# EAGLE design dip8 (EAGLE 6.5.0)
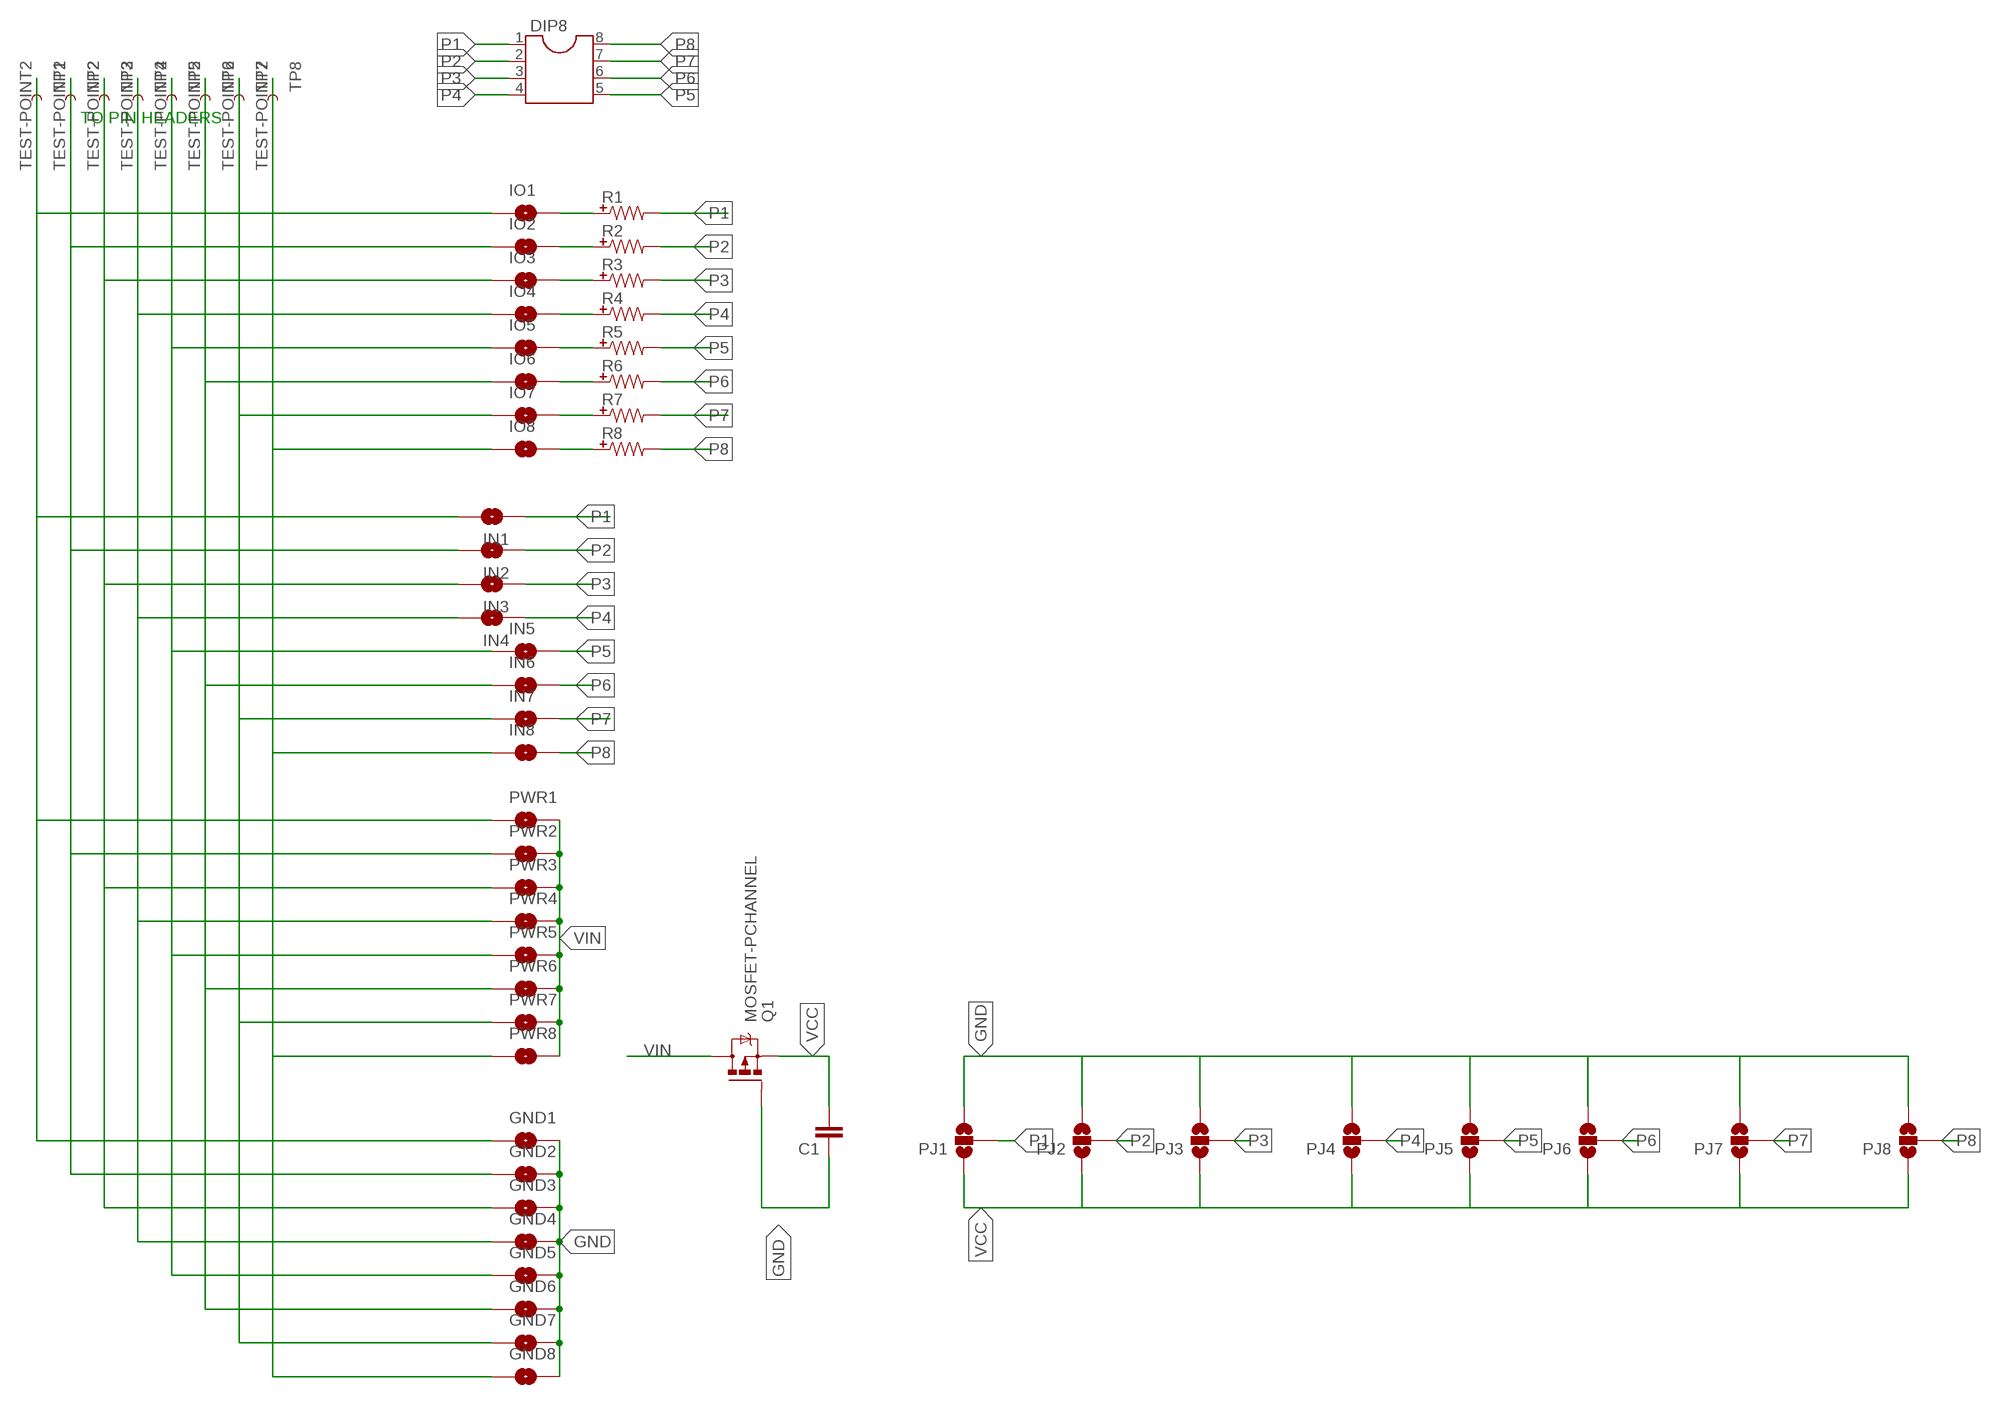
[diagram p0: schematic, sheet 1]

## Parts
C1  CAPUNIVERSAL  [0402-0603-0805-UNIVERSAL]
DIP8  DIL8  [DIL08]
GND1  SOLDERJUMPERNO  [SJ_2S-NO]
GND2  SOLDERJUMPERNO  [SJ_2S-NO]
GND3  SOLDERJUMPERNO  [SJ_2S-NO]
GND4  SOLDERJUMPERNO  [SJ_2S-NO]
GND5  SOLDERJUMPERNO  [SJ_2S-NO]
GND6  SOLDERJUMPERNO  [SJ_2S-NO]
GND7  SOLDERJUMPERNO  [SJ_2S-NO]
GND8  SOLDERJUMPERNO  [SJ_2S-NO]
IN1  SOLDERJUMPERNO  [SJ_2S-NO]
IN2  SOLDERJUMPERNO  [SJ_2S-NO]
IN3  SOLDERJUMPERNO  [SJ_2S-NO]
IN4  SOLDERJUMPERNO  [SJ_2S-NO]
IN5  SOLDERJUMPERNO  [SJ_2S-NO]
IN6  SOLDERJUMPERNO  [SJ_2S-NO]
IN7  SOLDERJUMPERNO  [SJ_2S-NO]
IN8  SOLDERJUMPERNO  [SJ_2S-NO]
IO1  SOLDERJUMPERNO  [SJ_2S-NO]
IO2  SOLDERJUMPERNO  [SJ_2S-NO]
IO3  SOLDERJUMPERNO  [SJ_2S-NO]
IO4  SOLDERJUMPERNO  [SJ_2S-NO]
IO5  SOLDERJUMPERNO  [SJ_2S-NO]
IO6  SOLDERJUMPERNO  [SJ_2S-NO]
IO7  SOLDERJUMPERNO  [SJ_2S-NO]
IO8  SOLDERJUMPERNO  [SJ_2S-NO]
PJ1  SOLDERJUMPER_2WAYT  [SJ_2]
PJ2  SOLDERJUMPER_2WAYT  [SJ_2]
PJ3  SOLDERJUMPER_2WAYT  [SJ_2]
PJ4  SOLDERJUMPER_2WAYT  [SJ_2]
PJ5  SOLDERJUMPER_2WAYT  [SJ_2]
PJ6  SOLDERJUMPER_2WAYT  [SJ_2]
PJ7  SOLDERJUMPER_2WAYT  [SJ_2]
PJ8  SOLDERJUMPER_2WAYT  [SJ_2]
PWR1  SOLDERJUMPERNO  [SJ_2S-NO]
PWR2  SOLDERJUMPERNO  [SJ_2S-NO]
PWR3  SOLDERJUMPERNO  [SJ_2S-NO]
PWR4  SOLDERJUMPERNO  [SJ_2S-NO]
PWR5  SOLDERJUMPERNO  [SJ_2S-NO]
PWR6  SOLDERJUMPERNO  [SJ_2S-NO]
PWR7  SOLDERJUMPERNO  [SJ_2S-NO]
PWR8  SOLDERJUMPERNO  [SJ_2S-NO]
Q1  MOSFET-PCHANNEL  [SOT23-3]
R1  RESISTORUNIVERSAL  [0402-0603-0805-UNIVERSAL]
R2  RESISTORUNIVERSAL  [0402-0603-0805-UNIVERSAL]
R3  RESISTORUNIVERSAL  [0402-0603-0805-UNIVERSAL]
R4  RESISTORUNIVERSAL  [0402-0603-0805-UNIVERSAL]
R5  RESISTORUNIVERSAL  [0402-0603-0805-UNIVERSAL]
R6  RESISTORUNIVERSAL  [0402-0603-0805-UNIVERSAL]
R7  RESISTORUNIVERSAL  [0402-0603-0805-UNIVERSAL]
R8  RESISTORUNIVERSAL  [0402-0603-0805-UNIVERSAL]
TP1  TEST-POINT2  [PAD.02X.02]
TP2  TEST-POINT2  [PAD.02X.02]
TP3  TEST-POINT2  [PAD.02X.02]
TP4  TEST-POINT2  [PAD.02X.02]
TP5  TEST-POINT2  [PAD.02X.02]
TP6  TEST-POINT2  [PAD.02X.02]
TP7  TEST-POINT2  [PAD.02X.02]
TP8  TEST-POINT2  [PAD.02X.02]

## Nets
C1: GND1.1 IN1.2 IO1.1 PWR1.1 TP1.P$1
C2: GND2.1 IN2.2 IO2.1 PWR2.1 TP2.P$1
C3: GND3.1 IN3.2 IO3.1 PWR3.1 TP3.P$1
C4: GND4.1 IN4.2 IO4.1 PWR4.1 TP4.P$1
C5: GND5.1 IN5.1 IO5.1 PWR5.1 TP5.P$1
C6: GND6.1 IN6.1 IO6.1 PWR6.1 TP6.P$1
C7: GND7.1 IN7.1 IO7.1 PWR7.1 TP7.P$1
C8: GND8.1 IN8.1 IO8.1 PWR8.1 TP8.P$1
GND: C1.- GND1.2 GND2.2 GND3.2 GND4.2 GND5.2 GND6.2 GND7.2 GND8.2 PJ1.3 PJ2.3 PJ3.3 PJ4.3 PJ5.3 PJ6.3 PJ7.3 PJ8.3 Q1.1(G)
N$9: IO1.2 R1.+
N$10: IO2.2 R2.+
N$11: IO3.2 R3.+
N$12: IO4.2 R4.+
N$13: IO5.2 R5.+
N$14: IO6.2 R6.+
N$15: IO7.2 R7.+
N$16: IO8.2 R8.+
P1: DIP8.1 IN1.1 PJ1.2 R1.-
P2: DIP8.2 IN2.1 PJ2.2 R2.-
P3: DIP8.3 IN3.1 PJ3.2 R3.-
P4: DIP8.4 IN4.1 PJ4.2 R4.-
P5: DIP8.5 IN5.2 PJ5.2 R5.-
P6: DIP8.6 IN6.2 PJ6.2 R6.-
P7: DIP8.7 IN7.2 PJ7.2 R7.-
P8: DIP8.8 IN8.2 PJ8.2 R8.-
VCC: C1.+ PJ1.1 PJ2.1 PJ3.1 PJ4.1 PJ5.1 PJ6.1 PJ7.1 PJ8.1 Q1.2(S)
VIN: PWR1.2 PWR2.2 PWR3.2 PWR4.2 PWR5.2 PWR6.2 PWR7.2 PWR8.2 Q1.3(D)

## Notes on the sheet
- TO PIN HEADERS

## Library data of the parts
C1 = tekdemo:CAP: Capacitor Standard 0603 ceramic capacitor, and 0.1" leaded capacitor.
DIP8 = ic-package:DIL8: Dual In Line / Socket
GND1-GND8 IN1-IN8 IO1-IO8 PWR1-PWR8 = SparkFun-Passives:SOLDERJUMPER: Solder Jumper Standard SMD solder jumper. Used to automate production. Two varients : Normally Open and Normally Closed are the same, but have different paste layers. NC will have a large amount of paste and should jumper during reflow.
PJ1-PJ8 = SparkFun-Passives:SOLDERJUMPER_2WAY: Solder Jumper 2 way solder jumper
Q1 = tekdemo:MOSFET-PCHANNEL: Generic PMOSFET; PROD_ID: TRANS-08285
R1-R8 = tekdemo:RESISTOR: Resistor Basic schematic elements and footprints for 0603, 1206, and PTH resistors.
TP1-TP8 = SparkFun-Passives:TEST-POINT: Bare copper test points for troubleshooting or ICT

## Board
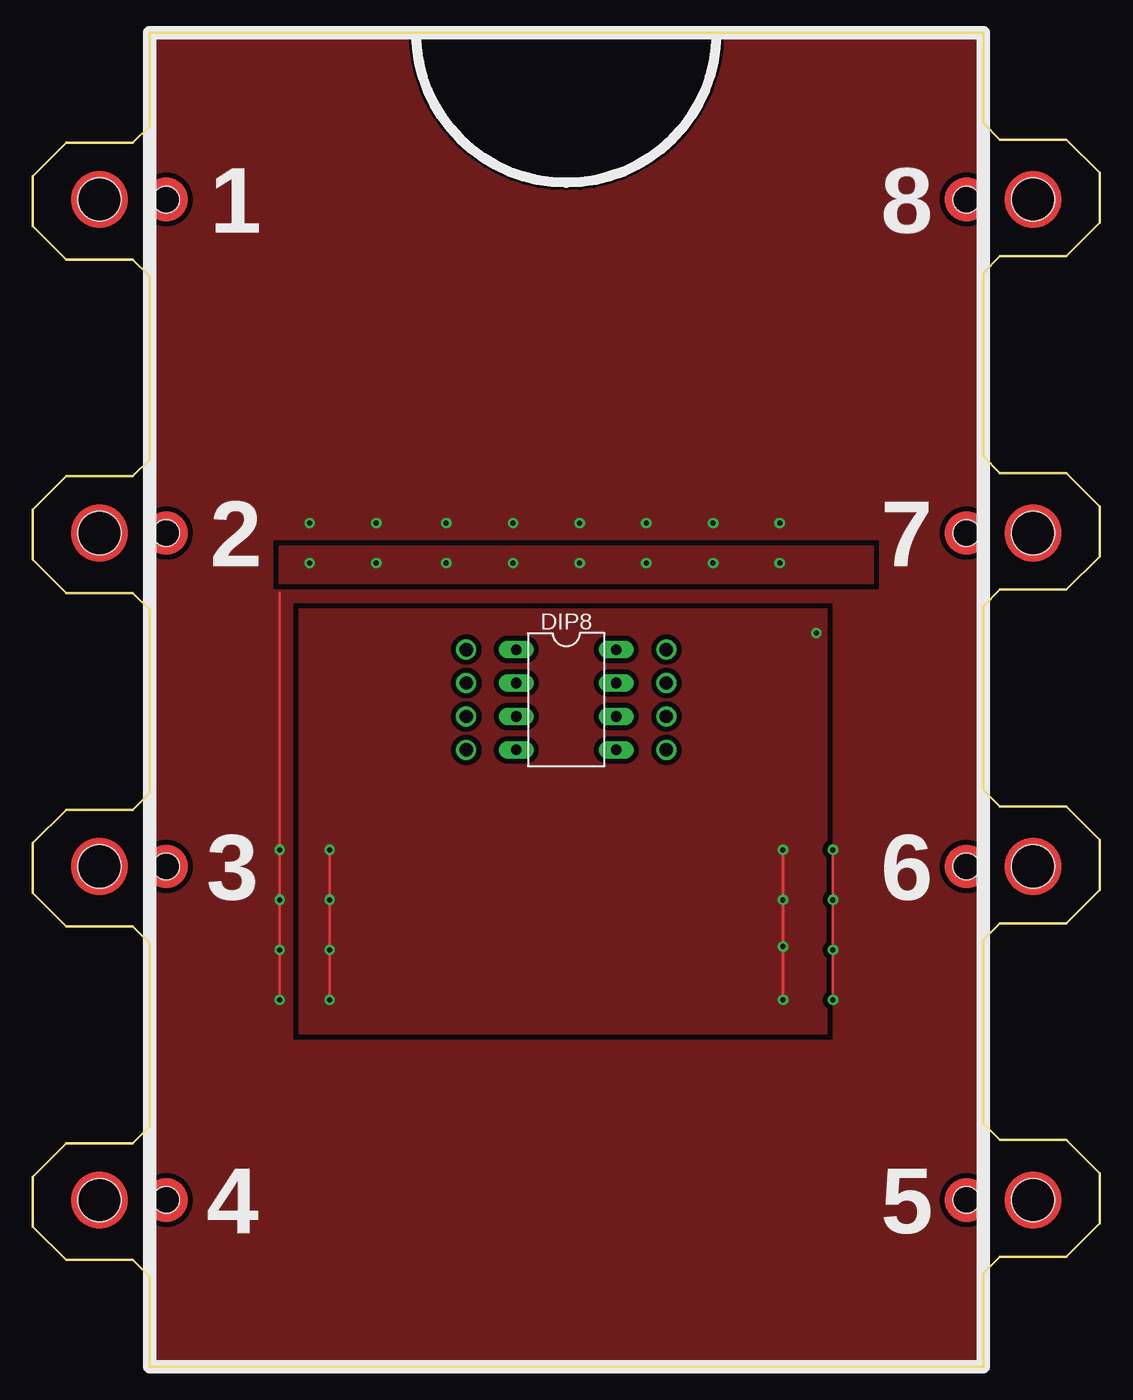
[diagram p1: board, top side]
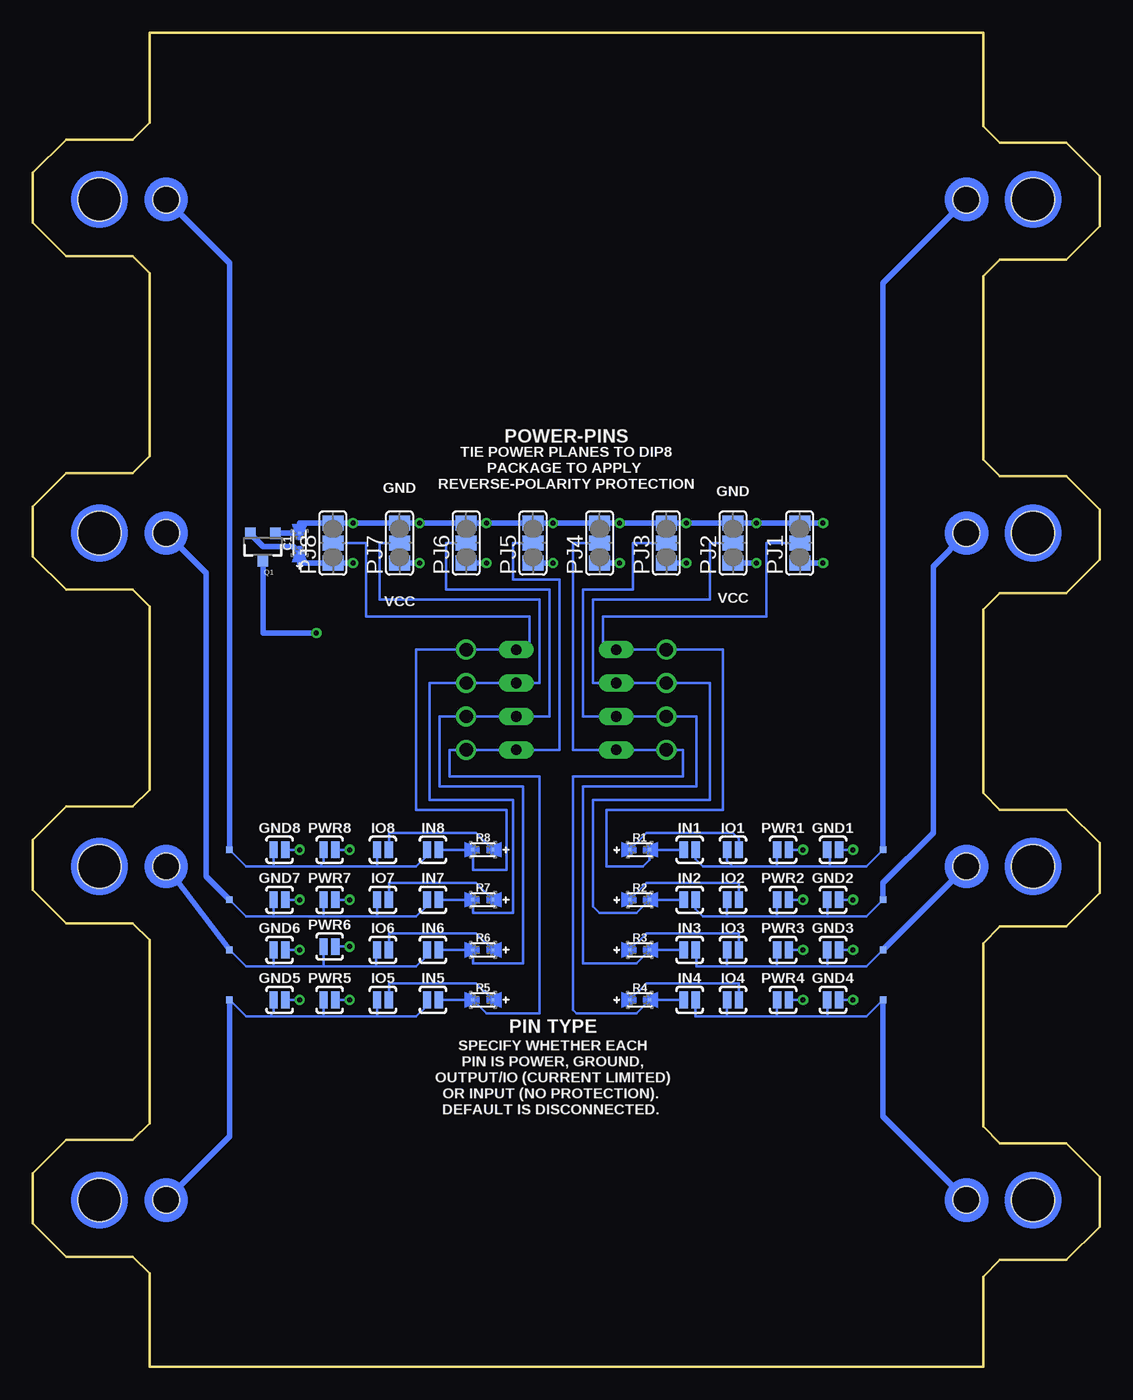
[diagram p2: board, bottom side, seen from below]

Size 81.28 x 101.6 mm. Coordinates in mm from the lower left corner, seen from the top.
Outline: 8.89,0 8.89,6.86 7.62,8.13 2.54,8.13 0,10.67 0,14.48 2.54,17.02 7.62,17.02 8.89,18.29 8.89,32.26 7.62,33.53 2.54,33.53 0,36.07 0,39.88 2.54,42.42 7.62,42.42 8.89,43.69 8.89,57.66 7.62,58.93 2.54,58.93 0,61.47 0,65.28 2.54,67.82 7.62,67.82 8.89,69.09 8.89,83.06 7.62,84.33 2.54,84.33 0,86.87 0,90.68 2.54,93.22 7.62,93.22 8.89,94.49 8.89,101.6 72.39,101.6 72.39,94.74 73.66,93.47 78.74,93.47 81.28,90.93 81.28,87.12 78.74,84.58 73.66,84.58 72.39,83.31 72.39,69.34 73.66,68.07 78.74,68.07 81.28,65.53 81.28,61.72 78.74,59.18 73.66,59.18 72.39,57.91 72.39,43.94 73.66,42.67 78.74,42.67 81.28,40.13 81.28,36.32 78.74,33.78 73.66,33.78 72.39,32.51 72.39,18.54 73.66,17.27 78.74,17.27 81.28,14.73 81.28,10.92 78.74,8.38 73.66,8.38 72.39,7.11 72.39,0 8.89,0
Copper layers (1*16): Top 0.035mm / dielectric 1.5mm / Bottom 0.035mm
Design rules "default *": minimum track width 10mil, minimum drill 0.6mm, track to track 8mil, track to pad 8mil, pad to pad 8mil, via to via 8mil, smd to smd 8mil, copper to edge 15mil, drill to drill 8mil, minimum pad ring 10mil, minimum via ring 8mil, stop-mask expansion 4mil, vias tented up to drill 20mil, thermal gap 10mil
Holes 3.3 mm at 5.08,12.7 5.08,38.1 5.08,63.5 5.08,88.9 76.2,12.7 76.2,38.1 76.2,63.5 76.2,88.9
Holes 2.03 mm at 10.16,12.7 10.16,38.1 10.16,63.5 10.16,88.9 71.12,12.7 71.12,38.1 71.12,63.5 71.12,88.9
tRestrict: area 29.2,90.2 to 52.1,101.6

### Footprints (pad centres in the part's own frame; a part is rotated, then mirrored left to right if it is on the bottom)
0402-0603-0805-UNIVERSAL = smd 0.254 x 0.254: + -0.762,0; - 0.762,0
DIL08 = drill 0.813 long: 1 -3.81,-3.81; 2 -1.27,-3.81; 3 1.27,-3.81; 4 3.81,-3.81; 5 3.81,3.81; 6 1.27,3.81; 7 -1.27,3.81; 8 -3.81,3.81
SJ_2S-NO = smd 0.635 x 1.27: 1 -0.45,0; 2 0.45,0
SJ_2 = smd 1.168 x 1.6: 1 -1.524,0; 2 0,0; 3 1.524,0
SOT23-3 = smd 0.8 x 0.9: 1 -0.95,-1; 2 0.95,-1; 3 0,1.1
PAD.02X.02 = smd 0.508 x 0.508: P$1 0,0

### Placement (x,y rotation side)
C1  60.96,62.74 90 bottom
DIP8  40.64,50.8 270 top
GND1  20.32,39.37 0 bottom
GND2  20.32,35.56 0 bottom
GND3  20.32,31.75 0 bottom
GND4  20.32,27.94 0 bottom
GND5  62.48,27.94 0 bottom
GND6  62.48,31.75 0 bottom
GND7  62.48,35.56 0 bottom
GND8  62.48,39.37 0 bottom
IN1  31.24,39.37 0 bottom
IN2  31.24,35.56 0 bottom
IN3  31.24,31.75 0 bottom
IN4  31.24,27.94 0 bottom
IN5  50.8,27.94 0 bottom
IN6  50.8,31.75 0 bottom
IN7  50.8,35.56 0 bottom
IN8  50.8,39.37 0 bottom
IO1  27.94,39.37 0 bottom
IO2  27.94,35.56 0 bottom
IO3  27.94,31.75 0 bottom
IO4  27.94,27.94 0 bottom
IO5  54.61,27.94 0 bottom
IO6  54.61,31.75 0 bottom
IO7  54.61,35.56 0 bottom
IO8  54.61,39.37 0 bottom
PJ1  22.86,62.74 90 bottom
PJ2  27.94,62.74 90 bottom
PJ3  33.02,62.74 90 bottom
PJ4  38.1,62.74 90 bottom
PJ5  43.18,62.74 90 bottom
PJ6  48.26,62.74 90 bottom
PJ7  53.34,62.74 90 bottom
PJ8  58.42,62.74 90 bottom
PWR1  24.13,39.37 0 bottom
PWR2  24.13,35.56 0 bottom
PWR3  24.13,31.75 0 bottom
PWR4  24.13,27.94 0 bottom
PWR5  58.67,27.94 0 bottom
PWR6  58.67,32 0 bottom
PWR7  58.67,35.56 0 bottom
PWR8  58.67,39.37 0 bottom
Q1  63.75,62.48 180 bottom
R1  35.05,39.37 0 bottom
R2  35.05,35.56 0 bottom
R3  35.05,31.75 0 bottom
R4  35.05,27.94 0 bottom
R5  46.99,27.94 180 bottom
R6  46.99,31.75 180 bottom
R7  46.99,35.56 180 bottom
R8  46.99,39.37 180 bottom
TP1  16.51,39.37 0 bottom
TP2  16.51,35.56 0 bottom
TP3  16.51,31.75 0 bottom
TP4  16.51,27.94 0 bottom
TP5  66.29,27.94 180 bottom
TP6  66.29,31.75 180 bottom
TP7  66.29,35.56 180 bottom
TP8  66.29,39.37 180 bottom

### Tracks (layer width: path | path; a pad name or v marks a point on that pad's centre or on a via)
C1
  Bottom 0.203: TP1.P$1 17.78,38.1 20.57,38.1 | 20.57,38.1 24.58,38.1 | 24.58,38.1 27.94,38.1 | IO1.1 28.39,38.55 27.94,38.1 | IN1.2 30.79,38.67 30.23,38.1 27.94,38.1 | PWR1.1 24.58,38.1 | GND1.1 20.57,39.37 20.57,38.1
  Bottom 0.406: TP1.P$1 16.51,82.55 10.16,88.9
C2
  Bottom 0.203: TP2.P$1 17.78,34.29 20.77,34.29 | 20.77,34.29 24.58,34.29 | 24.58,34.29 28.39,34.29 | 28.39,34.29 30.23,34.29 30.79,34.86 IN2.2 30.73,35.5 | GND2.1 20.77,34.29 | PWR2.1 24.58,34.29 | IO2.1 28.39,34.29
  Bottom 0.406: TP2.P$1 16.51,36.83 12.7,40.64 12.7,60.96 10.16,63.5
C3
  Bottom 0.203: TP3.P$1 17.78,30.48 20.77,30.48 | 20.77,30.48 GND3.1 | 24.58,30.48 20.77,30.48 | PWR3.1 24.58,30.48 | 24.58,30.48 28.39,30.48 | IO3.1 28.39,30.48 | 28.39,30.48 30.73,30.48 30.73,31.75 IN3.2
  Bottom 0.406: TP3.P$1 10.16,38.1
C4
  Bottom 0.203: TP4.P$1 17.78,26.67 20.77,26.67 | 20.77,26.67 24.58,26.67 | 24.58,26.67 28.39,26.67 | 28.39,26.67 30.79,26.67 IN4.2 | GND4.1 20.77,26.67 | PWR4.1 24.58,26.67 | IO4.1 28.39,26.67
  Bottom 0.406: TP4.P$1 16.51,19.05 10.16,12.7
C5
  Bottom 0.203: TP5.P$1 65.02,26.67 63.25,26.67 | 63.25,26.67 59.18,26.67 | 59.18,26.67 55.12,26.67 | 55.12,26.67 52.07,26.67 51.25,27.49 IN5.1 | GND5.1 62.93,26.98 63.25,26.67 | PWR5.1 59.12,26.73 59.18,26.67 | IO5.1 55.06,26.73 55.12,26.67
  Bottom 0.406: TP5.P$1 66.29,17.53 71.12,12.7
C6
  Bottom 0.203: TP6.P$1 65.02,30.48 62.99,30.48 | 62.99,30.48 59.12,30.48 | 59.12,30.48 55.12,30.48 | 55.12,30.48 52.07,30.48 51.25,31.3 IN6.1 | GND6.1 62.93,30.54 62.99,30.48 | PWR6.1 59.12,30.48 | IO6.1 55.12,31.75 55.12,30.48
  Bottom 0.406: TP6.P$1 71.12,38.1
C7
  Bottom 0.203: TP7.P$1 65.02,34.29 62.99,34.29 | 62.99,34.29 59.12,34.29 | 59.12,34.29 55.06,34.29 | 55.06,34.29 52.07,34.29 51.25,35.11 IN7.1 | GND7.1 62.93,34.35 62.99,34.29 | PWR7.1 59.12,34.29 | IO7.1 55.06,34.29
  Bottom 0.406: TP7.P$1 68.07,37.34 68.07,60.45 71.12,63.5
C8
  Bottom 0.203: TP8.P$1 65.02,38.1 62.99,38.1 | 62.99,38.1 59.44,38.1 | 59.44,38.1 55.12,38.1 | 55.12,38.1 52.07,38.1 51.25,38.92 IN8.1 | GND8.1 62.93,38.16 62.99,38.1 | IO8.1 55.06,38.16 55.12,38.1 | PWR8.1 59.12,38.41 59.44,38.1
  Bottom 0.406: TP8.P$1 66.29,84.07 71.12,88.9
GND  (via drill 0.38)
  Top 0.203: v18.8,27.94 v18.8,31.75 v18.8,35.56 v18.8,39.37 18.8,58.93 | v60.96,27.94 v60.96,31.75 v60.96,35.56 v60.96,39.37
  Bottom 0.203: GND1.2 v18.8,39.37 | GND4.2 v18.8,27.94 | GND3.2 v18.8,31.75 | GND2.2 v18.8,35.56 | GND5.2 v60.96,27.94 | GND6.2 v60.96,31.75 | GND7.2 v60.96,35.56 | GND8.2 v60.96,39.37 | 60.96,63.48 C1.- 60.96,64.26
  Bottom 0.406: Q1.1 60.96,63.48 | 60.96,64.26 PJ8.3 v56.9,64.26 PJ7.3 v51.82,64.26 PJ6.3 v46.74,64.26 PJ5.3 v41.66,64.26 PJ4.3 v36.58,64.26 PJ3.3 v31.5,64.26 PJ2.3 v26.16,64.26 PJ1.3 v21.08,64.26
  pour Top (isolate 0.381, rank 6): 8.89,0 8.89,101.6 72.39,101.6 72.39,0
N$1  (via drill 1.02 pad 1.52)
  other vias: 33.02,54.61
N$2  (via drill 1.02 pad 1.52)
  other vias: 33.02,52.07
N$3  (via drill 1.02 pad 1.52)
  other vias: 33.02,49.53
N$4  (via drill 1.02 pad 1.52)
  other vias: 33.02,46.99
N$5  (via drill 1.02 pad 1.52)
  other vias: 48.26,46.99
N$6  (via drill 1.02 pad 1.52)
  other vias: 48.26,49.53
N$7  (via drill 1.02 pad 1.52)
  other vias: 48.26,52.07
N$8  (via drill 1.02 pad 1.52)
  other vias: 48.26,54.61
N$9
  Bottom 0.203: IO1.2 27.49,40.19 27.94,40.64 34.54,40.64 R1.+
N$10
  Bottom 0.203: R2.+ 34.54,36.83 27.49,36.83 IO2.2
N$11
  Bottom 0.203: IO3.2 27.49,33.02 34.54,33.02 R3.+
N$12
  Bottom 0.203: IO4.2 27.49,29.21 34.54,29.21 R4.+
N$13
  Bottom 0.203: IO5.2 54.16,29.21 47.5,29.21 R5.+
N$14
  Bottom 0.203: IO6.2 54.16,33.02 47.5,33.02 R6.+
N$15
  Bottom 0.203: IO7.2 54.16,36.83 47.5,36.83 R7.+
N$16
  Bottom 0.203: IO8.2 54.16,40.64 47.5,40.64 R8.+
P1
  Bottom 0.203: IN1.1 R1.- 34.29,38.61 34.8,38.1 37.59,38.1 37.59,42.42 28.7,42.42 28.7,54.61 DIP8.1 37.85,54.61 37.85,57.15 25.4,57.15 25.4,62.74 PJ1.2
P2
  Bottom 0.203: IN2.1 R2.- 35.31,34.54 38.1,34.54 38.61,35.05 38.61,43.18 29.72,43.18 29.72,52.07 DIP8.2 38.61,52.07 38.61,58.42 29.72,58.42 29.72,62.74 PJ2.2
P3
  Bottom 0.203: IN3.1 R3.- 35.31,30.73 39.37,30.73 39.37,44.2 30.73,44.2 30.73,49.53 DIP8.3 39.37,49.53 39.37,59.18 35.56,59.18 35.56,62.74 PJ3.2
P4
  Bottom 0.203: IN4.1 R4.- 35.31,26.92 39.88,26.92 40.13,27.18 40.13,44.96 31.75,44.96 31.75,46.99 DIP8.4 40.13,46.99 40.13,62.74 PJ4.2
P5
  Bottom 0.203: IN5.2 R5.- 46.74,26.92 42.67,26.92 42.67,44.96 49.53,44.96 49.53,46.99 DIP8.5 41.15,46.99 41.15,59.94 44.7,59.94 44.7,62.74 PJ5.2
P6
  Bottom 0.203: IN6.2 R6.- 47.75,30.73 43.94,30.73 43.94,44.2 50.29,44.2 50.29,49.53 DIP8.6 41.91,49.53 41.91,59.18 49.78,59.18 49.78,62.74 PJ6.2
P7
  Bottom 0.203: IN7.2 R7.- 47.75,34.54 44.7,34.54 44.7,43.18 51.05,43.18 51.05,52.07 DIP8.7 42.67,52.07 42.67,58.42 54.86,58.42 54.86,62.74 PJ7.2
P8
  Bottom 0.203: IN8.2 R8.- 47.75,37.85 45.21,37.85 45.21,42.42 52.07,42.42 52.07,54.61 DIP8.8 43.43,54.61 43.43,57.15 55.88,57.15 55.88,62.74 PJ8.2
VCC  (via drill 0.38)
  Bottom 0.203: 60.96,61.21 C1.+ | 64.7,63.43 Q1.2
  Bottom 0.406: PJ1.1 v21.08,61.21 | PJ2.1 v26.16,61.21 | PJ3.1 v31.5,61.21 | PJ4.1 v36.58,61.21 | PJ5.1 v41.66,61.21 | PJ6.1 v46.74,61.21 | PJ7.1 v51.82,61.21 | v56.9,61.21 PJ8.1 60.96,61.21 | C1.+ 61.47,62.48 63.75,62.48 64.7,63.43
  pour Top (isolate 0.381): 64.01,59.69 18.8,59.69 18.8,62.48 64.01,62.48
VIN  (via drill 0.38)
  Top 0.203: v22.61,27.94 v22.61,31.75 v22.61,35.56 v22.61,39.37 | v57.15,39.37 v57.15,35.56 v57.15,32 v57.15,27.94
  Bottom 0.203: PWR1.2 v22.61,39.37 | PWR2.2 v22.61,35.56 | PWR8.2 v57.15,39.37 | PWR7.2 v57.15,35.56 | PWR6.2 v57.15,32 | PWR5.2 v57.15,27.94 | PWR4.2 v22.61,27.94 | v22.61,31.75 PWR3.2
  Bottom 0.406: Q1.3 63.75,55.88 v59.69,55.88
  pour Top (isolate 0.381, rank 2): 20.32,25.4 20.32,57.66 60.45,57.66 60.45,25.4
(copper drawn outside any net)
  shapes: Bottom circle x16, Top circle x16

### Text on the board
tPlace: 1 | 8 | 2 | 7 | 3 | 6 | 4 | 5
bPlace: POWER-PINS | TIE POWER PLANES TO DIP8 / PACKAGE TO APPLY / REVERSE-POLARITY PROTECTION | GND | GND | VCC | VCC | PIN TYPE | SPECIFY WHETHER EACH / PIN IS POWER, GROUND, / OUTPUT/IO (CURRENT LIMITED) / OR INPUT (NO PROTECTION). / DEFAULT IS DISCONNECTED.
tStop: AWESOME ALLITERRATED NAME